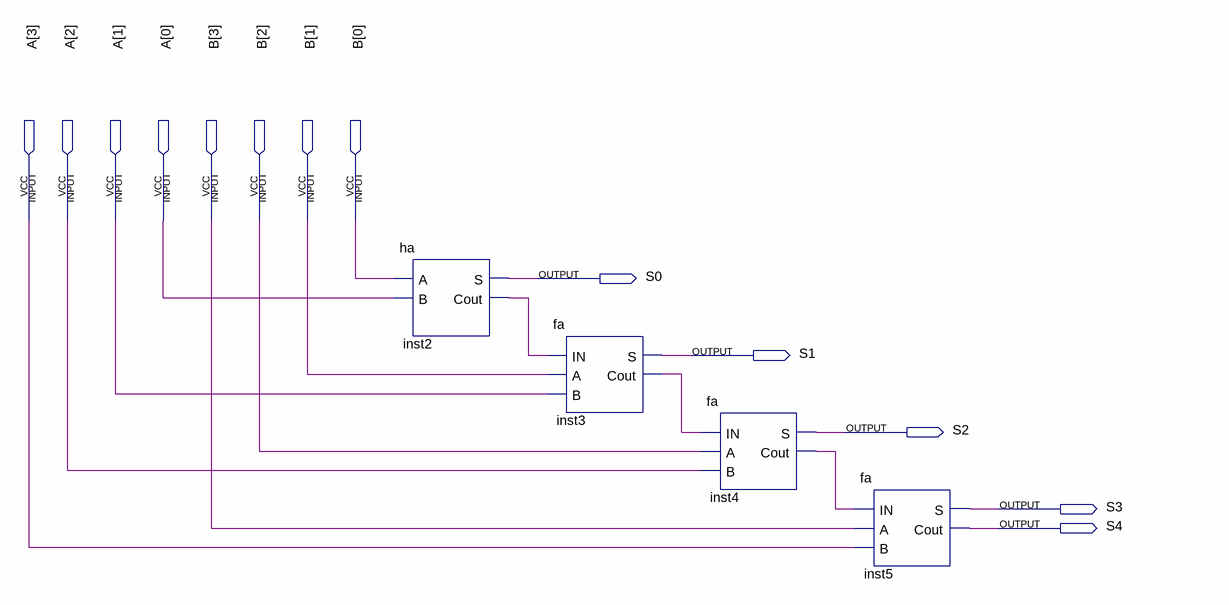
[diagram p0: schematic sheet]
// Quartus schematic adder.bdf as structural Verilog: 4 symbols, 13 pins
module adder (
  input  [3:0] A,
  input  [3:0] B,
  output S0,
  output S1,
  output S2,
  output S3,
  output S4
);

  wire inst2_cout, inst3_cout, inst4_cout;

  ha inst2 (.A(B[0]), .B(A[0]), .S(S0), .Cout(inst2_cout));
  fa inst3 (.IN(inst2_cout), .A(B[1]), .B(A[1]), .S(S1), .Cout(inst3_cout));
  fa inst4 (.IN(inst3_cout), .A(B[2]), .B(A[2]), .S(S2), .Cout(inst4_cout));
  fa inst5 (.IN(inst4_cout), .A(B[3]), .B(A[3]), .S(S3), .Cout(S4));
endmodule
